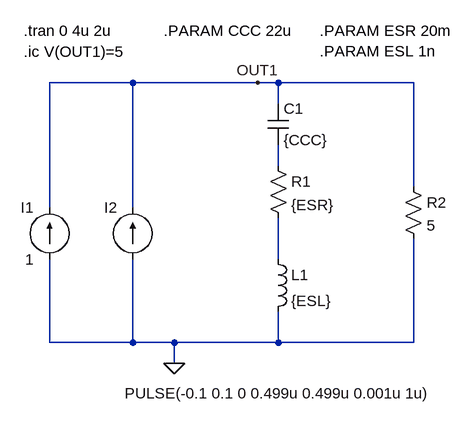
[diagram p0: schematic Fig_11-1_Buck_CRL-Ripple.asc]
Fig_11-1_Buck_CRL-Ripple.asc, the LTspice schematic file:
Version 4
SHEET 1 1276 1352
WIRE 64 96 -64 96
WIRE 256 96 64 96
WIRE 288 96 256 96
WIRE 496 96 288 96
WIRE 288 128 288 96
WIRE 288 224 288 192
WIRE 496 256 496 96
WIRE -64 288 -64 96
WIRE 64 288 64 96
WIRE 288 368 288 304
WIRE -64 496 -64 368
WIRE 64 496 64 368
WIRE 64 496 -64 496
WIRE 128 496 64 496
WIRE 288 496 288 448
WIRE 288 496 128 496
WIRE 496 496 496 336
WIRE 496 496 288 496
WIRE 128 528 128 496
FLAG 128 528 0
FLAG 256 96 OUT1
SYMBOL ind 272 352 R0
SYMATTR InstName L1
SYMATTR Value {ESL}
SYMBOL current 64 368 R180
WINDOW 0 24 80 Left 2
WINDOW 3 -462 -206 Left 2
WINDOW 123 0 0 Left 2
WINDOW 39 0 0 Left 2
SYMATTR InstName I2
SYMATTR Value PULSE(-0.1 0.1 0 0.499u 0.499u 0.001u 1u)
SYMBOL current -64 368 R180
WINDOW 0 24 80 Left 2
WINDOW 3 24 0 Left 2
WINDOW 123 0 0 Left 2
WINDOW 39 0 0 Left 2
SYMATTR InstName I1
SYMATTR Value 1
SYMBOL res 272 208 R0
SYMATTR InstName R1
SYMATTR Value {ESR}
SYMBOL cap 272 128 R0
SYMATTR InstName C1
SYMATTR Value {CCC}
SYMBOL res 480 240 R0
SYMATTR InstName R2
SYMATTR Value 5
TEXT -104 16 Left 2 !.tran 0 4u 2u
TEXT -104 48 Left 2 !.ic V(OUT1)=5
TEXT 352 16 Left 2 !.PARAM ESR 20m\n.PARAM ESL 1n
TEXT 112 16 Left 2 !.PARAM CCC 22u

The netlist it stands for:
* Fig_11-1_Buck_CRL-Ripple.asc
L1 N002 0 {ESL}
I2 0 OUT1 PULSE(-0.1 0.1 0 0.499u 0.499u 0.001u 1u)
I1 0 OUT1 1
R1 N001 N002 {ESR}
C1 OUT1 N001 {CCC}
R2 OUT1 0 5
.tran 0 4u 2u
.ic V(OUT1)=5
.PARAM ESR 20m
.PARAM ESL 1n
.PARAM CCC 22u
.backanno
.end